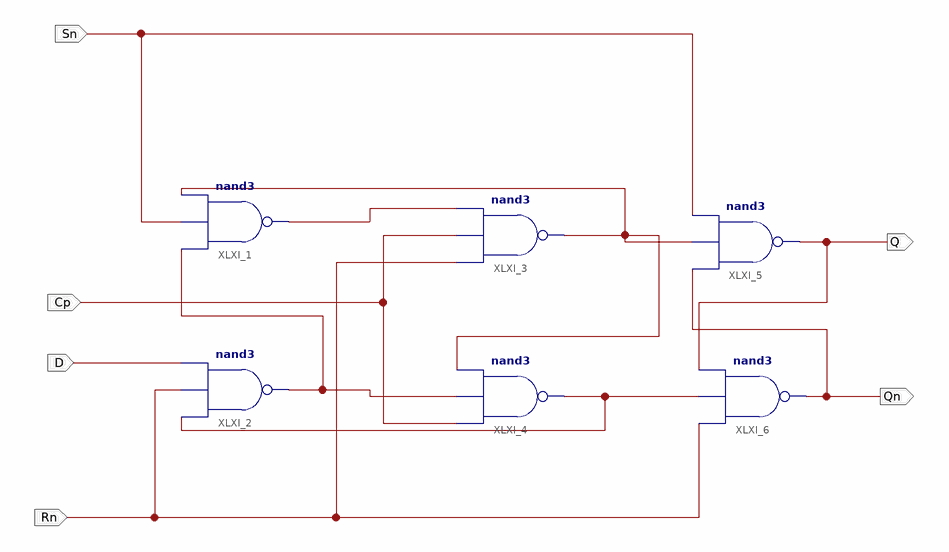
[diagram p0: schematic sheet 1]
// Xilinx ISE schematic MB_DFF.sch (kintex7) as structural Verilog: 6 symbols, 6 ports
module MB_DFF (
  input  Sn,
  input  Cp,
  input  D,
  input  Rn,
  output Q,
  output Qn
);

  wire XLXN_15, XLXN_18, XLXN_23, XLXN_25;

  nand XLXI_1 (XLXN_15, XLXN_25, Sn, XLXN_18);
  nand XLXI_2 (XLXN_25, XLXN_23, Rn, D);
  nand XLXI_3 (XLXN_18, Rn, Cp, XLXN_15);
  nand XLXI_4 (XLXN_23, Cp, XLXN_25, XLXN_18);
  nand XLXI_5 (Q, Qn, XLXN_18, Sn);
  nand XLXI_6 (Qn, Rn, XLXN_23, Q);
endmodule
